# EAGLE design MagusConnectors (EAGLE 9.2.1)
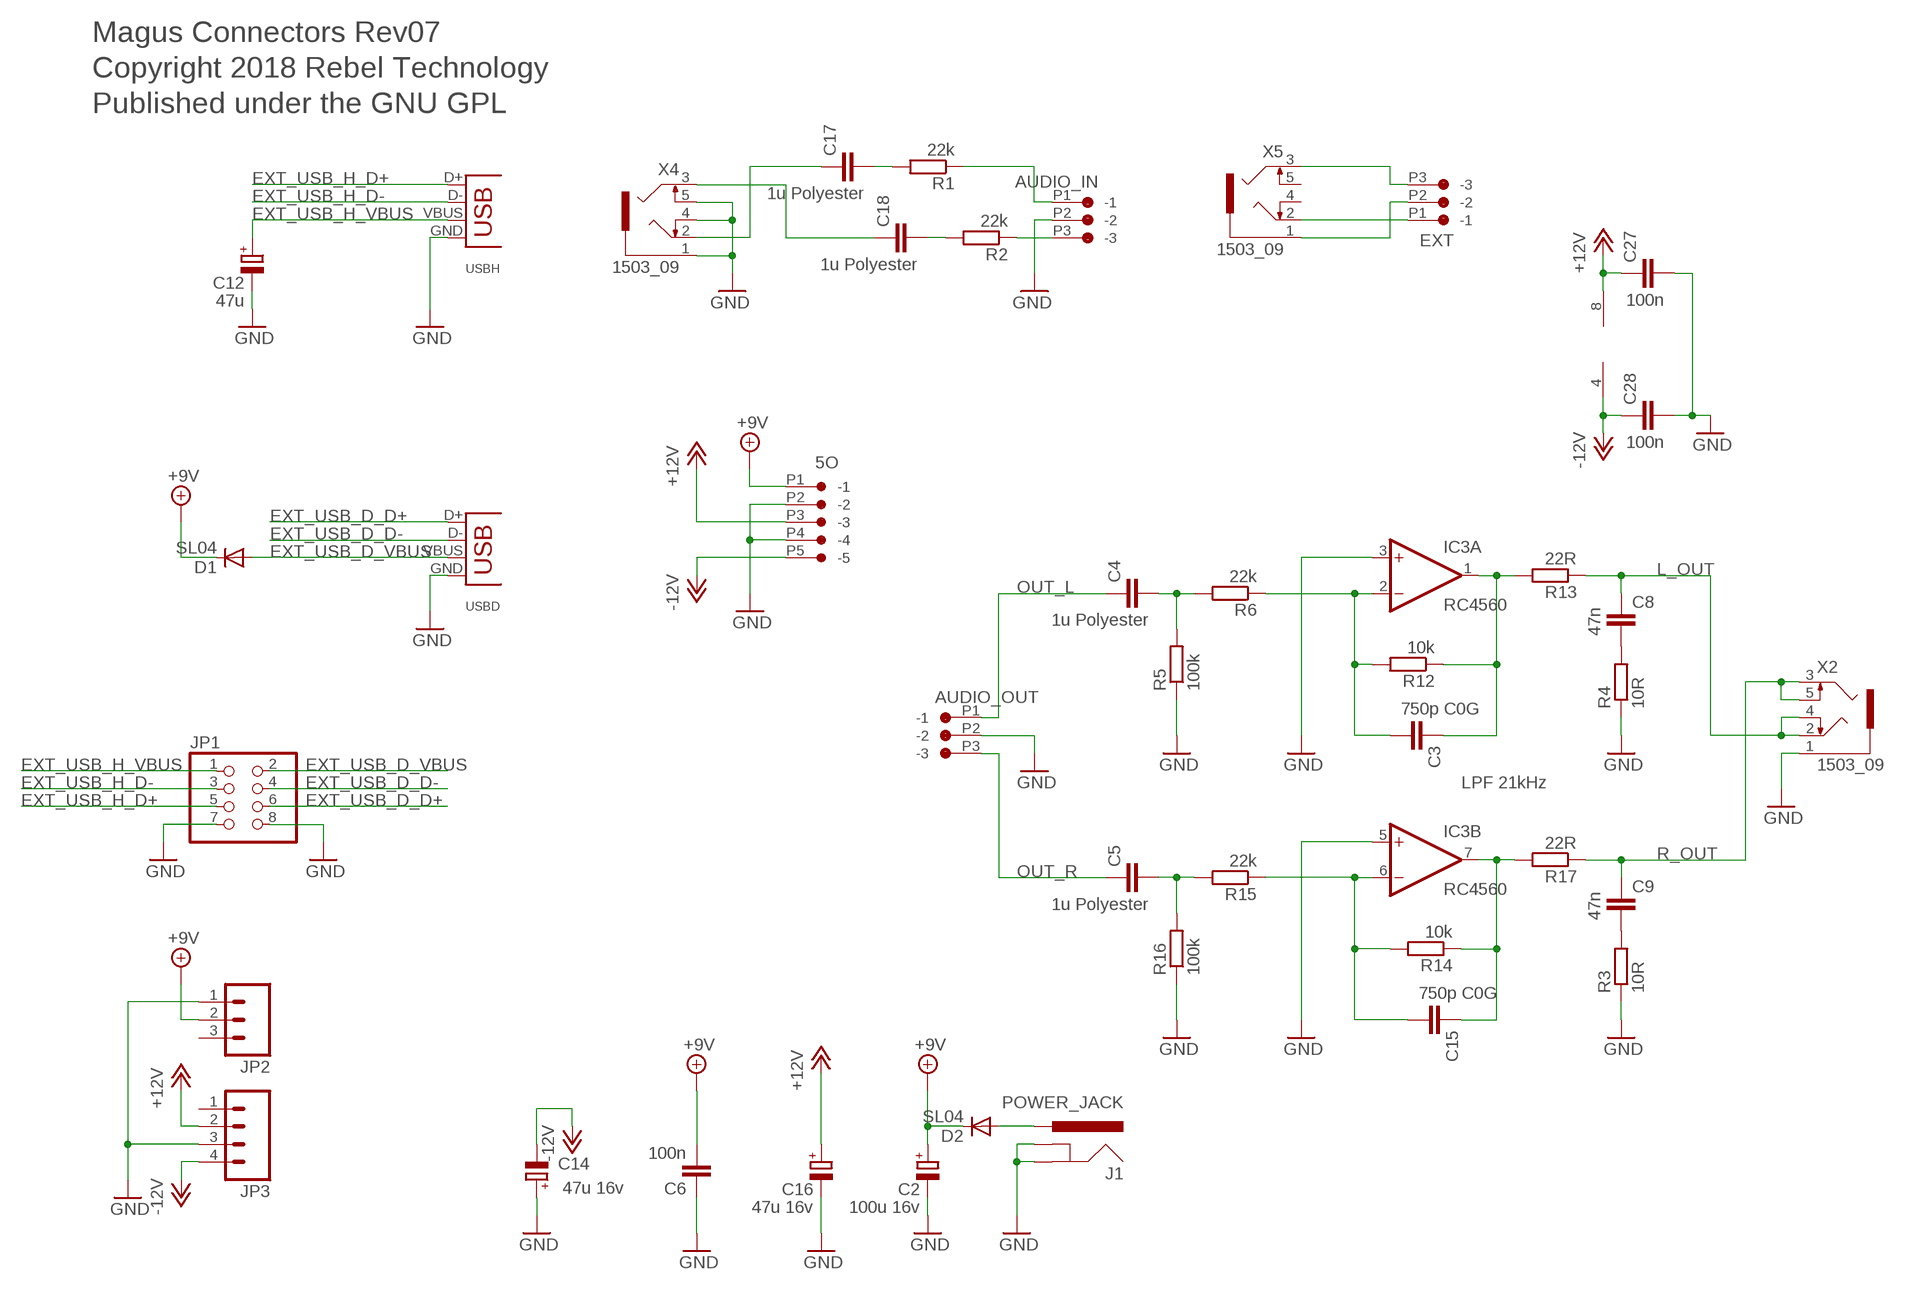
[diagram p0: schematic, sheet 1]

## Parts
5O  CON-JST_PH_5W  [CON-JST_PH_5W]
AUDIO_IN  CON-JST_PH_3W  [CON-JST_PH_3W]
AUDIO_OUT  CON-JST_PH_3W  [CON-JST_PH_3W]
C2  100u 16v  CPOL-EUD  [PANASONIC_D]
C3  750p C0G  C-EUC0603  [C0603]
C4  1u Polyester  C-EUC1210  [C1210]
C5  1u Polyester  C-EUC1210  [C1210]
C6  100n  C-EUC0603  [C0603]
C8  47n  C-EUC0603  [C0603]
C9  47n  C-EUC0603  [C0603]
C12  47u  CPOL-EUB  [PANASONIC_B]
C14  47u 16v  CPOL-EUB  [PANASONIC_B]
C15  750p C0G  C-EUC0603  [C0603]
C16  47u 16v  CPOL-EUB  [PANASONIC_B]
C17  1u Polyester  C-EUC1210  [C1210]
C18  1u Polyester  C-EUC1210  [C1210]
C27  100n  C-EUC0603  [C0603]
C28  100n  C-EUC0603  [C0603]
D1  SL04  DIODESMA  [SMA-DIODE]
D2  SL04  DIODESMA  [SMA-DIODE]
EXT  CON-JST_PH_3W  [CON-JST_PH_3W]
IC3  RC4560  NE5532D  [SO08]
J1  POWER_JACK  [DC_JACK_SLOT]
JP1  PINHD-2X4  [2X04]
JP2  M03PTH  [1X03]
JP3  M04PTH  [1X04]
R1  22k  R-EU_R0603  [R0603]
R2  22k  R-EU_R0603  [R0603]
R3  10R  R-EU_R0603  [R0603]
R4  10R  R-EU_R0603  [R0603]
R5  100k  R-EU_R0603  [R0603]
R6  22k  R-EU_R0603  [R0603]
R12  10k  R-EU_R0603  [R0603]
R13  22R  R-EU_R0603  [R0603]
R14  10k  R-EU_R0603  [R0603]
R15  22k  R-EU_R0603  [R0603]
R16  100k  R-EU_R0603  [R0603]
R17  22R  R-EU_R0603  [R0603]
USBD  USB-B-H  [USB-B-H]
USBH  USB-A-H  [USB-A-H]
X2  1503_09  [1503_09]
X4  1503_09  [1503_09]
X5  1503_09  [1503_09]

## Nets
+9V: 5O.P1(-1) C2.+ C6.2 D1.C D2.C JP2.2
+12V: 5O.P3(-3) C16.+ C27.1 IC3.8(P:V+) JP3.2
-12V: 5O.P5(-5) C14.- C28.1 IC3.4(P:V-) JP3.4
EXT_USB_D_D+: JP1.6 USBD.D+
EXT_USB_D_D-: JP1.4 USBD.D-
EXT_USB_D_VBUS: D1.A JP1.2 USBD.VBUS
EXT_USB_H_D+: JP1.5 USBH.D+
EXT_USB_H_D-: JP1.3 USBH.D-
EXT_USB_H_VBUS: C12.+ JP1.1 USBH.VBUS
GND: 5O.P2(-2) 5O.P4(-4) AUDIO_IN.P2(-2) AUDIO_OUT.P2(-2) C2.- C6.1 C12.- C14.+ C16.- C27.2 C28.2 IC3.3(A:+IN) IC3.5(B:+IN) J1.GND J1.GNDBREAK JP1.7 JP1.8 JP2.1 JP3.3 R3.1 R4.1 R5.1 R16.1 USBD.GND USBH.GND X2.1 X4.1 X4.4 X4.5
L_OUT: C8.1 R13.1 X2.2 X2.4
N$1: C15.2 IC3.6(B:-IN) R14.2 R15.1
N$2: C15.1 IC3.7(B:OUT) R14.1 R17.2
N$3: C3.2 IC3.2(A:-IN) R6.1 R12.2
N$4: C5.2 R15.2 R16.2
N$5: AUDIO_IN.P3(-3) R2.1
N$6: AUDIO_IN.P1(-1) R1.1
N$7: EXT.P1(-1) X5.2
N$8: C4.2 R5.2 R6.2
N$9: D2.A J1.PWR
N$12: C9.2 R3.2
N$14: EXT.P3(-3) X5.3
N$15: EXT.P2(-2) X5.1
N$17: C17.2 R1.2
N$18: C18.2 R2.2
N$19: C3.1 IC3.1(A:OUT) R12.1 R13.2
N$20: C18.1 X4.3
N$21: C8.2 R4.2
N$25: C17.1 X4.2
OUT_L: AUDIO_OUT.P1(-1) C4.1
OUT_R: AUDIO_OUT.P3(-3) C5.1
R_OUT: C9.1 R17.1 X2.3 X2.5
Unconnected: JP2.3 JP3.1 X5.4 X5.5

## Notes on the sheet
- Magus Connectors Rev07
- Copyright 2018 Rebel Technology
- Published under the GNU GPL
- LPF 21kHz

## Library data of the parts
5O = Rebel:CON-JST_PH_5W
AUDIO_IN AUDIO_OUT EXT = Rebel:CON-JST_PH_3W
C2 C12 C14 C16 = Rebel:CPOL-EU: POLARIZED CAPACITOR, European symbol
C3-C5 C8 C9 C15 C17 C18 C27 C28 = Rebel:C-EU: CAPACITOR, European symbol
C6 = rcl:C-EU: CAPACITOR, European symbol
D1 D2 = SparkFun:DIODE: Diode These are standard reverse protection diodes and small signal diodes. SMA package can handle up to about 1A. SOD-323 can handle about 200mA. What the SOD-323 package when ordering, there are some mfgs out there that are 5-pin packages.
IC3 = linear:NE5532: AUDIO AMPLIFIER
J1 = Rebel:POWER_JACK: Power Jack This is the standard 5.5mm barrel jack for power. The PTH is the most common, proven, reliable, footprint. All others are experimental. The Slot footprint only works if the mill layer is transmitted to the PCB fab house so be warned. Spark Fun Electronics SKU : PRT-00119. Mating wall wart : TOL-00298 (and others)
JP1 = pinhead:PINHD-2X4: PIN HEADER
JP2 = SparkFun:M03: Header 3 Standard 3-pin 0.1" header. Use with straight break away headers (SKU : PRT-00116), right angle break away headers (PRT-00553), swiss pins (PRT-00743), machine pins (PRT-00117), and female headers (PRT-00115). Molex polarized connector foot print use with SKU : PRT-08232 with associated crimp pins and housings.
JP3 = SparkFun:M04: Header 4 Standard 4-pin 0.1" header. Use with straight break away headers (SKU : PRT-00116), right angle break away headers (PRT-00553), swiss pins (PRT-00743), machine pins (PRT-00117), and female headers (PRT-00115). Molex polarized connector foot print use with SKU : PRT-08231 with associated crimp pins and housings. 1MM SMD Version SKU: PRT-10208
R1-R6 R12-R17 = resistor:R-EU_: RESISTOR, European symbol
USBD USBH = con-usb-3:USB: USB Connectors
X2 X4 X5 = con-lumberg:1503_09: Jack connectors according to JISC 6560, 3.5 mm Klinkeneinbaukupplung nach JISC 6560, 3,5 mm, 3-polig/ stereo, abgewinkelte Ausführung, mit 2 Öffnern und Lötaugen, für Leiterplatten Rückseitenmontage Source: http://www.lumberg.com/Produkte/PDFs/1503_09.pdf; OC_FARNELL: 1243244; OC_NEWARK: unknown

## Net classes
1 power: width 0.178 mm, drill 0.305 mm, clearance 0.178 mm to class 0, clearance 0.178 mm

## Board
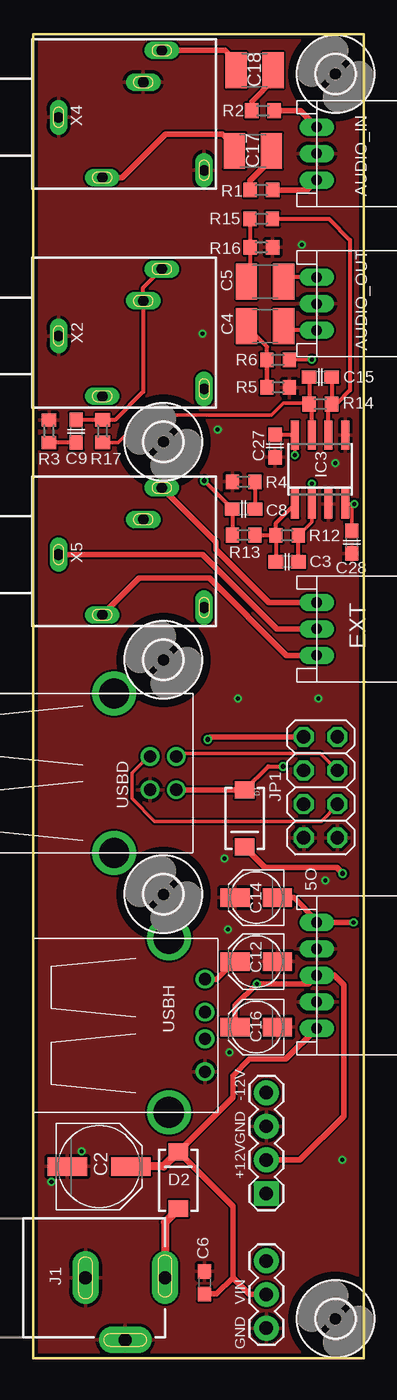
[diagram p1: board, top side]
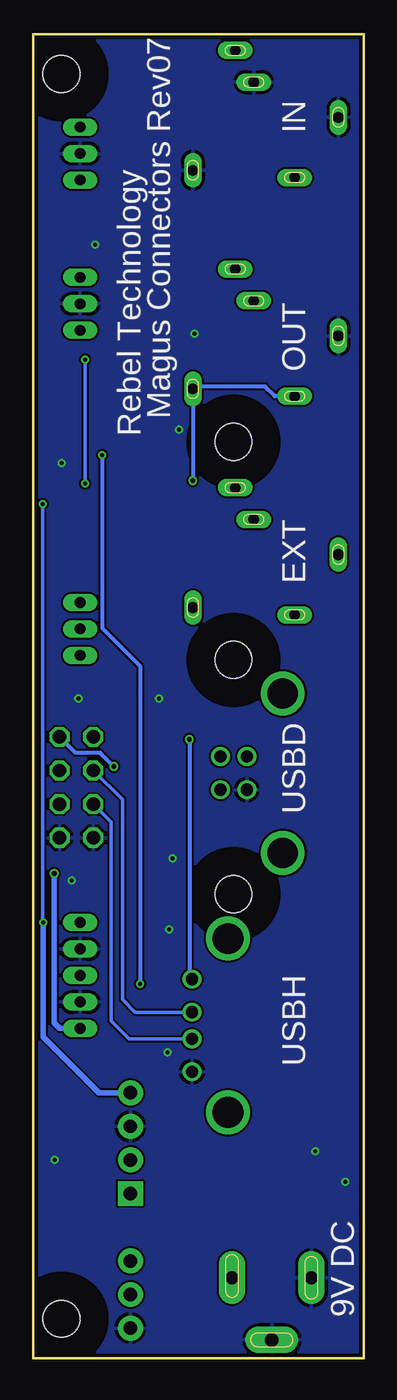
[diagram p2: board, bottom side, seen from below]

Size 25 x 100 mm. Coordinates in mm from the lower left corner, seen from the top.
Outline: 25,100 25,0 0,0 0,100 25,100
Copper layers (1*16): Top 0.035mm / dielectric 1.5mm / Bottom 0.035mm
Design rules "SeeedStudio_2layer_DRU_no_angle_20140221": minimum track width 6mil, minimum drill 12mil, track to track 6mil, track to pad 6mil, pad to pad 6mil, via to via 6mil, smd to smd 0mil, copper to edge 10mil, drill to drill 10mil, minimum pad ring 10mil, minimum via ring 6mil, stop-mask expansion 2mil, vias tented up to drill 100mil, thermal gap 10mil

### Footprints (pad centres in the part's own frame; a part is rotated, then mirrored left to right if it is on the bottom)
CON-JST_PH_5W = drill 0.8 long: P1 0,0; P2 -2,0; P3 -4,0; P4 -6,0; P5 -8,0
CON-JST_PH_3W = drill 0.8 long: P1 0,0; P2 -2,0; P3 -4,0
PANASONIC_D = smd 3 x 1.4: + 2.4,0; - -2.4,0
C0603 = smd 1.1 x 1: 1 -0.85,0; 2 0.85,0
C1210 = smd 1.6 x 2.7: 1 -1.4,0; 2 1.4,0
PANASONIC_B = smd 2.2 x 1.4: + 1.6,0; - -1.6,0
SMA-DIODE = smd 1.27 x 1.47: A -2.15,0; C 2.15,0
SO08 = smd 0.6 x 2.2: 1 -1.905,-2.6; 2 -0.635,-2.6; 3 0.635,-2.6; 4 1.905,-2.6; 5 1.905,2.6; 6 0.635,2.6; 7 -0.635,2.6; 8 -1.905,2.6
DC_JACK_SLOT = drill 1 pad 2 long: GND 0,4.743; GNDBREAK 4.697,7.742; PWR 0,10.749
2X04 = drill 1.016 octagon: 1 -3.81,-1.27; 2 -3.81,1.27; 3 -1.27,-1.27; 4 -1.27,1.27; 5 1.27,-1.27; 6 1.27,1.27; 7 3.81,-1.27; 8 3.81,1.27
1X03 = drill 1.016 pad 1.88: 1 0,0; 2 2.54,0; 3 5.08,0
1X04 = drill 1.016 pad 1.88 square: 1 0,0 | drill 1.016 pad 1.88: 2 2.54,0; 3 5.08,0; 4 7.62,0
R0603 = smd 1 x 1.1: 1 -0.85,0; 2 0.85,0
2,8 = hole 2.8: 0,0
USB-B-H = drill 0.914: D+ 0,1.25; D- 1.981,1.25; GND 0,-1.25; VBUS 1.981,-1.25 | drill 2.286: P$1 -2.718,-6.02; P$2 -2.718,6.02
USB-A-H = drill 0.914: D+ 2.718,-1.003; D- 2.718,1.003; GND 2.718,-3.493; VBUS 2.718,3.493 | drill 2.311: P$5 0,-6.566; P$6 0,6.566
1503_09 = drill 0.8 pad 1.2 long: 1 0,-2.1; 2 -4.55,-5.4; 3 5.05,-9.9; 4 -4,-13.1; 5 2.65,-8.5

### Placement (x,y rotation side)
5O  21.45,24.93 270 top
AUDIO_IN  21.45,89 270 top
AUDIO_OUT  21.45,77.65 270 top
C2  4.99,14.49 0 top
C3  19.21,60.17 0 top
C4  17.54,77.95 180 top
C5  17.54,81.32 180 top
C6  12.96,5.72 270 top
C8  15.92,64.15 0 top
C9  3.26,70.02 270 top
C12  16.87,29.98 180 top
C14  16.87,34.8 180 top
C15  21.72,74.1 0 top
C16  16.87,25.02 180 top
C17  16.62,91.19 0 top
C18  16.75,97.29 0 top
C27  18.29,68.92 270 top
C28  24.09,61.65 270 top
D1  15.98,40.77 270 top
D2  10.99,13.47 90 top
EXT  21.45,53.09 270 top
IC3  21.7,67.14 0 top
J1  -0.78,6.1 270 top
JP1  21.73,43.13 270 top
JP2  17.64,2.29 90 top
JP3  17.64,12.45 90 top
R1  17.25,88.23 180 top
R2  17.38,94.23 180 top
R3  1.22,70.02 270 top
R4  15.92,66.21 0 top
R5  18.53,73.33 180 top
R6  18.52,75.4 180 top
R12  19.21,62.16 0 top
R13  15.92,62.18 0 top
R14  21.72,72.07 0 top
R15  17.25,86.06 180 top
R16  17.25,83.92 180 top
R17  5.26,70.03 270 top
U$1  [2,8]  22.86,3 90 top
U$2  [2,8]  9.86,69.22 90 top
U$3  [2,8]  9.86,35.06 90 top
U$4  [2,8]  9.86,52.75 90 top
U$5  [2,8]  22.86,97 90 top
USBD  8.85,44.2 0 top
USBH  10.27,25.15 0 top
X2  -0.17,77.22 90 top
X4  -0.17,93.73 90 top
X5  -0.17,60.71 90 top

### Tracks (layer width: path | path; a pad name or v marks a point on that pad's centre or on a via)
+9V  (via drill 0.35)
  Top 0.406: D1.C 17.52,37.09 22.95,37.09 v23.41,36.63 | 5O.P1 19.13,22.61 16.37,22.61 15.1,21.34 15.1,19.73 D2.C 15.1,11.51 15.1,6.1 | C6.2 13.87,4.87 15.1,6.1 | JP2.2 16.37,4.83 15.1,6.1
  Top 0.61: D2.C 9.86,14.49 C2.+
  Bottom 0.406: v23.41,36.63 23.41,25.33 23,24.93 5O.P1
+12V  (via drill 0.3)
  Top 0.254: IC3.8 19.79,68.24 v19.78,68.22
  Top 0.305: IC3.8 18.32,69.74 C27.1
  Top 0.406: C16.+ 15.27,26.66 v16.92,28.3 v16.92,28.29 20.81,28.29 5O.P3 22.68,28.93 22.71,28.96 23.48,28.2 23.48,18.29 20.18,14.99 JP3.2
  Bottom 0.305: v19.78,68.22 19.78,55.16 16.92,52.3 v16.92,28.3
-12V  (via drill 0.3)
  Top 0.254: v24.28,64.51 24.09,64.41 C28.1 | IC3.4 23.63,64.51 v24.28,64.51 | v24.28,64.51 v24.28,64.52
  Top 0.406: v24.22,32.93 5O.P5 21.45,33.06 19.7,34.8 C14.-
  Bottom 0.254: v24.28,64.52 24.28,32.98 v24.22,32.93
  Bottom 0.406: v24.22,32.93 24.22,24.27 20.02,20.07 JP3.4
EXT_USB_D_D+
  Top 0.254: JP1.6 23,41.79 21.78,40.57 9.19,40.57 7.47,42.29 7.47,44.2 8.72,45.45 USBD.D+
EXT_USB_D_D-
  Top 0.254: JP1.4 21.7,45.7 11.13,45.7 10.88,45.45 USBD.D-
EXT_USB_D_VBUS  (via drill 0.35)
  Top 0.305: D1.A 17.77,44.71 v18.91,44.71
  Top 0.406: D1.A 15.96,42.95 USBD.VBUS
  Bottom 0.305: v18.91,44.71 19.92,45.73 21.78,45.73 JP1.2
EXT_USB_H_D+
  Bottom 0.254: USBH.D+ 17.75,24.15 19.11,25.5 19.11,40.51 JP1.5
EXT_USB_H_D-
  Bottom 0.254: USBH.D- 17.28,26.15 18.25,27.13 18.25,42.2 JP1.3
EXT_USB_H_VBUS  (via drill 0.35)
  Top 0.406: JP1.1 13.39,46.95 v13.19,46.74 | C12.+ 13.86,28.64 USBH.VBUS
  Bottom 0.305: v13.19,46.74 13.19,29.1 USBH.VBUS
GND  (via drill 0.3)
  other vias: 14.46,37.76 22.08,36.12 14.72,32.4 21.57,49.83 15.48,49.83 22.84,67.61 13.96,70.15 12.81,77.39 20.3,84.12 14.85,23.13 23.36,15 3.67,15.64 1.39,13.35
  pour Top: 26.48,-7.06 -4.94,-7.06 -4.94,100.75 26.48,100.75
  pour Bottom: 26.75,-7.33 -4.94,-7.33 -4.94,101.75 26.75,101.75
L_OUT  (via drill 0.35)
  Top 0.305: R13.1 C8.1 12.94,66.28 v12.94,66.3
  Bottom 0.305: v12.94,66.3 v12.93,66.31 X2.4 12.74,73.41 7.48,73.41 6.74,72.67 X2.2
N$1
  Top 0.305: R15.1 22.37,86.06 23.96,84.47 23.96,73.12 22.91,72.07 R14.2 | IC3.6 22.33,71.84 R14.2 | C15.2 R14.2
N$2
  Top 0.254: R17.2 6.41,69.18 8.49,71.25 18.02,71.25 18.91,72.14 20.7,72.14 20.82,72.02 R14.1
  Top 0.305: IC3.7 21.06,71.87 R14.1 C15.1
N$3  (via drill 0.3)
  Top 0.254: R6.1 19.44,75.42 v21.07,75.42 | R12.2 21.07,63.18 21.07,64.53 IC3.2 v21.07,66.07
  Top 0.305: C3.2 R12.2
  Bottom 0.254: v21.07,75.42 v21.07,66.07
N$4
  Top 0.305: R15.2 R16.2 16.41,80.72 16.3,80.62 16.3,81.15 C5.2
N$5
  Top 0.406: AUDIO_IN.P3 20.21,94.23 R2.1
N$6
  Top 0.406: AUDIO_IN.P1 20.68,88.23 R1.1
N$7
  Top 0.406: X5.2 8,58.93 13.32,58.93 19.16,53.09 EXT.P1
N$8
  Top 0.305: R6.2 17.67,75.31 17.66,75.3 R5.2 17.68,76.41 C4.2
N$9
  Top 0.61: D2.A 9.97,10.3 J1.PWR
N$12
  Top 0.305: C9.2 R3.2
N$14
  Top 0.406: EXT.P3 17.83,57.09 13.83,61.09 13.83,61.66 X5.3
N$15
  Top 0.406: EXT.P2 18.43,55.09 12.81,60.71 X5.1
N$17
  Top 0.406: C17.2 17.64,90.81 17.64,90.17 16.4,88.94 R1.2
N$18
  Top 0.406: R2.2 16.53,94.91 18.15,96.53 C18.2
N$19
  Top 0.305: R12.1 C3.1 | R12.1 18.36,63.1 IC3.1 | R13.2 18.33,62.18 R12.1
N$20
  Top 0.406: X4.3 14.49,98.78 15.22,98.05 15.22,97.41 C18.1
N$21
  Top 0.305: R4.2 C8.2
N$25
  Top 0.406: X4.2 6.74,89.18 10.02,92.46 14.33,92.46 15.22,91.57 C17.1
OUT_L
  Top 0.305: AUDIO_OUT.P1 19.23,77.65 C4.1
OUT_R
  Top 0.305: AUDIO_OUT.P3 19.27,81.65 C5.1
R_OUT
  Top 0.305: C9.1 3.37,70.88 R17.1 6.2,70.88 8.33,73.01 X2.5 8.33,80.87 X2.3

### Text on the board
tPlace: -12V | GND | +12V | VIN | GND
bPlace: Magus Connectors Rev07 | IN | Rebel Technology | OUT | EXT | USBD | USBH | 9V DC